# Altium schematic sheet MCU.SchDoc
size A; SheetNumber: 3; SheetTotal: 5
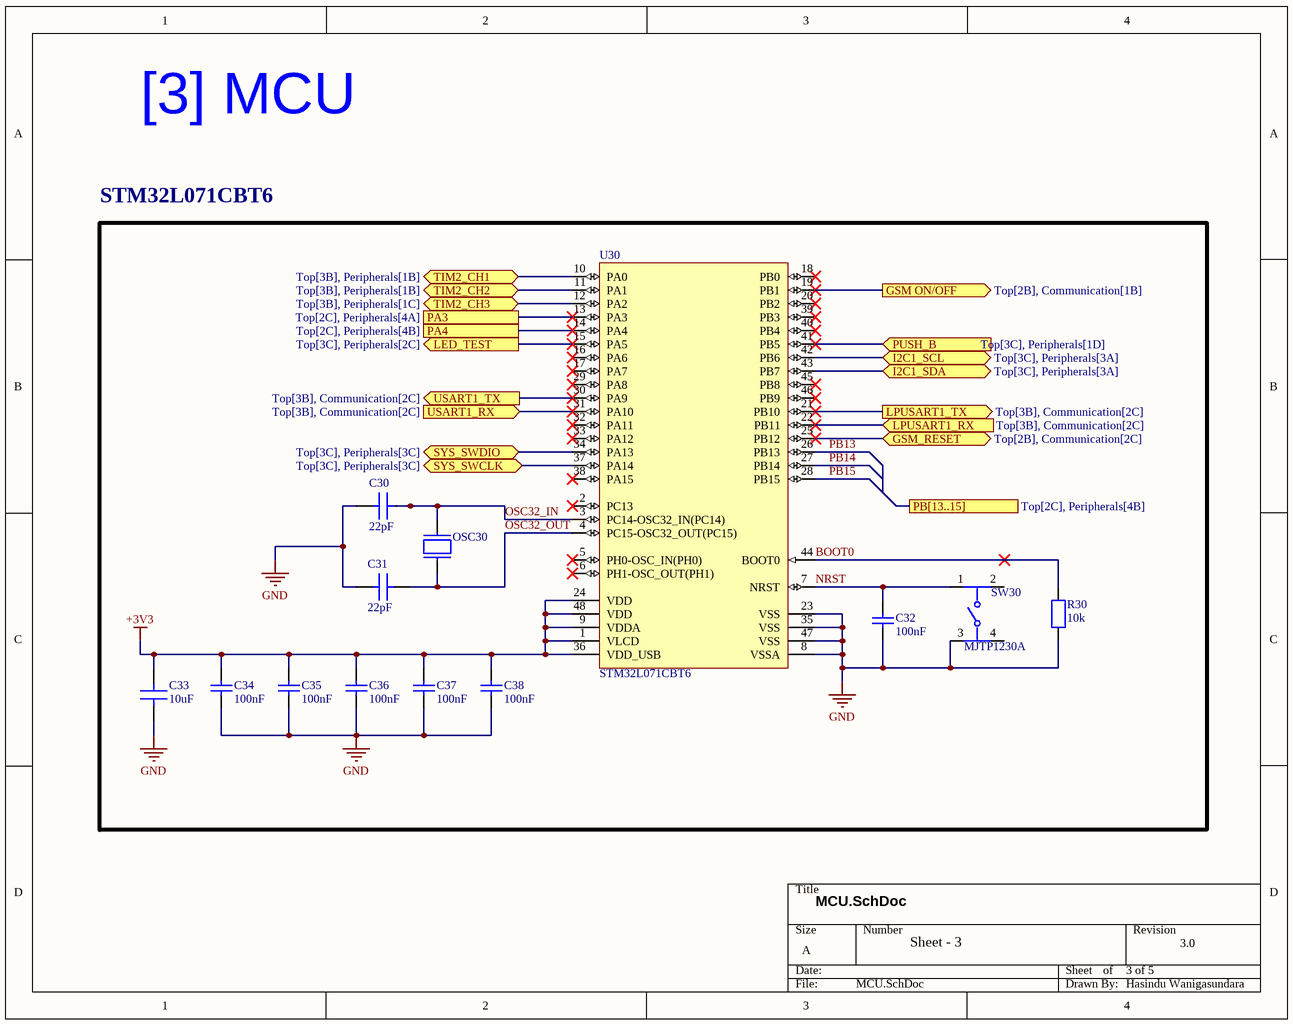
[diagram p0: MCU.SchDoc]

## Parts
C30  22pF  [CAP_1206]
C31  22pF  [CAP_1206]
C32  100nF  [CAPC2013X140X50NL20T25]
C33  10uF  [CAP_1206]
C34  100nF  [CAPC2013X140X50NL20T25]
C35  100nF  [CAPC2013X140X50NL20T25]
C36  100nF  [CAPC2013X140X50NL20T25]
C37  100nF  [CAPC2013X140X50NL20T25]
C38  100nF  [CAPC2013X140X50NL20T25]
OSC30  CRYSTAL OSC  [Crystal_OSC]  (value not drawn)
R30  10k  [RES_1206]
SW30  MJTP1230A  [FP-MJTP1230A-MFG]
U30  STM32L071CBT6  [STM-LQFP48_M]

## Blocks framed on the sheet
STM32L071CBT6: C30-C38 OSC30 R30 SW30 U30

## Ports
GSM ON/OFF (out, see Top[2B], Communication[1B]), GSM_RESET (bidir, see Top[2B], Communication[2C]), I2C1_SCL (bidir, see Top[3C], Peripherals[3A]), I2C1_SDA (bidir, see Top[3C], Peripherals[3A]), LED_TEST (out, see Top[3C], Peripherals[2C]), LPUSART1_RX (in, see Top[3B], Communication[2C]), LPUSART1_TX (out, see Top[3B], Communication[2C]), PA3 (see Top[2C], Peripherals[4A]), PA4 (see Top[2C], Peripherals[4B]), PB[13..15] (see Top[2C], Peripherals[4B]), PUSH_B (in, see Top[3C], Peripherals[1D]), SYS_SWCLK (bidir, see Top[3C], Peripherals[3C]), SYS_SWDIO (bidir, see Top[3C], Peripherals[3C]), TIM2_CH1 (bidir, see Top[3B], Peripherals[1B]), TIM2_CH2 (bidir, see Top[3B], Peripherals[1B]), TIM2_CH3 (bidir, see Top[3B], Peripherals[1C]), USART1_RX (in, see Top[3B], Communication[2C]), USART1_TX (out, see Top[3B], Communication[2C])

## Nets
+3V3: C33.2 C34.2 C35.2 C36.2 C37.2 C38.2 U30.1(VLCD) U30.9(VDDA) U30.24(VDD) U30.36(VDD_USB) U30.48(VDD)
GND: C30.2 C31.1 C32.1 C33.1 C34.1 C35.1 C36.1 C37.1 C38.1 R30.2 SW30.3 U30.8(VSSA) U30.23(VSS) U30.35(VSS) U30.47(VSS)
BOOT0: R30.1 U30.44(BOOT0)
GSM ON/OFF: U30.19(PB1) ; port GSM ON/OFF
GSM_RESET: U30.25(PB12) ; port GSM_RESET
I2C1_SCL: U30.42(PB6) ; port I2C1_SCL
I2C1_SDA: U30.43(PB7) ; port I2C1_SDA
LED_TEST: U30.15(PA5) ; port LED_TEST
LPUSART1_RX: U30.22(PB11) ; port LPUSART1_RX
LPUSART1_TX: U30.21(PB10) ; port LPUSART1_TX
NRST: C32.2 SW30.1 U30.7(NRST)
OSC32_IN: C30.1 OSC30.2 U30.3(PC14-OSC32_IN(PC14))
OSC32_OUT: C31.2 OSC30.1 U30.4(PC15-OSC32_OUT(PC15))
PA3: U30.13(PA3) ; port PA3
PA4: U30.14(PA4) ; port PA4
PB13: U30.26(PB13)
PB14: U30.27(PB14)
PB15: U30.28(PB15)
PUSH_B: U30.41(PB5) ; port PUSH_B
SYS_SWCLK: U30.37(PA14) ; port SYS_SWCLK
SYS_SWDIO: U30.34(PA13) ; port SYS_SWDIO
TIM2_CH1: U30.10(PA0) ; port TIM2_CH1
TIM2_CH2: U30.11(PA1) ; port TIM2_CH2
TIM2_CH3: U30.12(PA2) ; port TIM2_CH3
USART1_RX: U30.31(PA10) ; port USART1_RX
USART1_TX: U30.30(PA9) ; port USART1_TX

Not connected (* = marked no-connect by the designer): SW30 2 4; U30 2(PC13)* 5(PH0-OSC_IN(PH0))* 6(PH1-OSC_OUT(PH1))* 16(PA6)* 17(PA7)* 18(PB0)* 20(PB2)* 29(PA8)* 32(PA11)* 33(PA12)* 38(PA15)* 39(PB3)* 40(PB4)* 45(PB8)* 46(PB9)*

## Notes on the sheet
- [3] MCU
- MCU.SchDoc
- Sheet - 3
- 3 of 5
- 3.0
- Hasindu Wanigasundara

## Library data of the parts
C30 C31 C33 = CAP_1206: SMD 3.2mm × 1.6mm size capacitor (1206); Manufacturer: *; Manufacturer Part Number: *
C32 C34-C38 = CMP-2007-04663-1: Part Number: 0805YD105MAT2A; Manufacturer: AVX Interconnect / Elco
OSC30 = CRYSTAL OSC: CRYSTAL 32.768kHz 12.5pF SMD
R30 = RES_1206: SMD 3.2mm × 1.6mm size resistor (1206); Manufacturer: *; Manufacturer part number: *
SW30 = CMP-47024-000004-1: SWITCH TACTILE SPST-NO 0.05A 12V; Mechanical Life: 100000Cycles; Throw Configuration: SPST; Actuator Length: 1.4mm; Switch Travel: 0.25mm; Actuator Color: Black; Operating Force: 160gf; Contact Resistance: 100mR; Actuator Type: Standard; Switch Function: Off-Mom; Actuator Material: Thermoplastic; Illumination Type: Non-Illuminated; Current Rating: 50mA; Min Operating Temperature: -20°C; Series: MJTP; Electrical Life: 100000Cycles; Mount: Through Hole; Packaging: Bulk; Color: Black; Package Quantity: 2000; Voltage Rating (DC): 12V; REACH SVHC: No SVHC; Orientation: Straight; Termination: PC Pin; Contact Material: Bronze; RoHS Compliant: Yes; Max Voltage Rating (DC): 12V; Max Operating Temperature: 70°C; Contact Plating: Silver
U30 = CMP-1546-00070-1: ARM Cortex-M0+ 32 Bit 32MHz 37 LQFP-48(7x7) Microcontrollers RoHS; Operating Frequency(F) (Processor speed) (MHz): 32; FLASH Size (Prog) (kB): 192; Supply Voltage(Vcc) min (V): 1.8; Internal RAM Size (kB): 20; I/Os (High Current): 40; Data E2PROM nom (B): 6144; D/A Converter: 2; Packing: Tray; Core: ARM Cortex-M0+; DatasheetVersion: Rev. 2; ComponentLink1Description: Manufacturer URL; ComponentLink2Description: Datasheet; Package Description: 48-Pin Low Profile Quad Flat Package, Body 7 x 7 mm, Pitch 0.5 mm; Mounting Technology: Surface Mount; Package Reference: LQFP48; ComponentLink1URL: http://www.st.com/; ComponentLink2URL: http://www.st.com/st-web-ui/static/active/en/resource/technical/document/datasheet/DM00141036.pdf